# Altium schematic sheet NRF_remote_control_matrix_oled.SchDoc
size A4
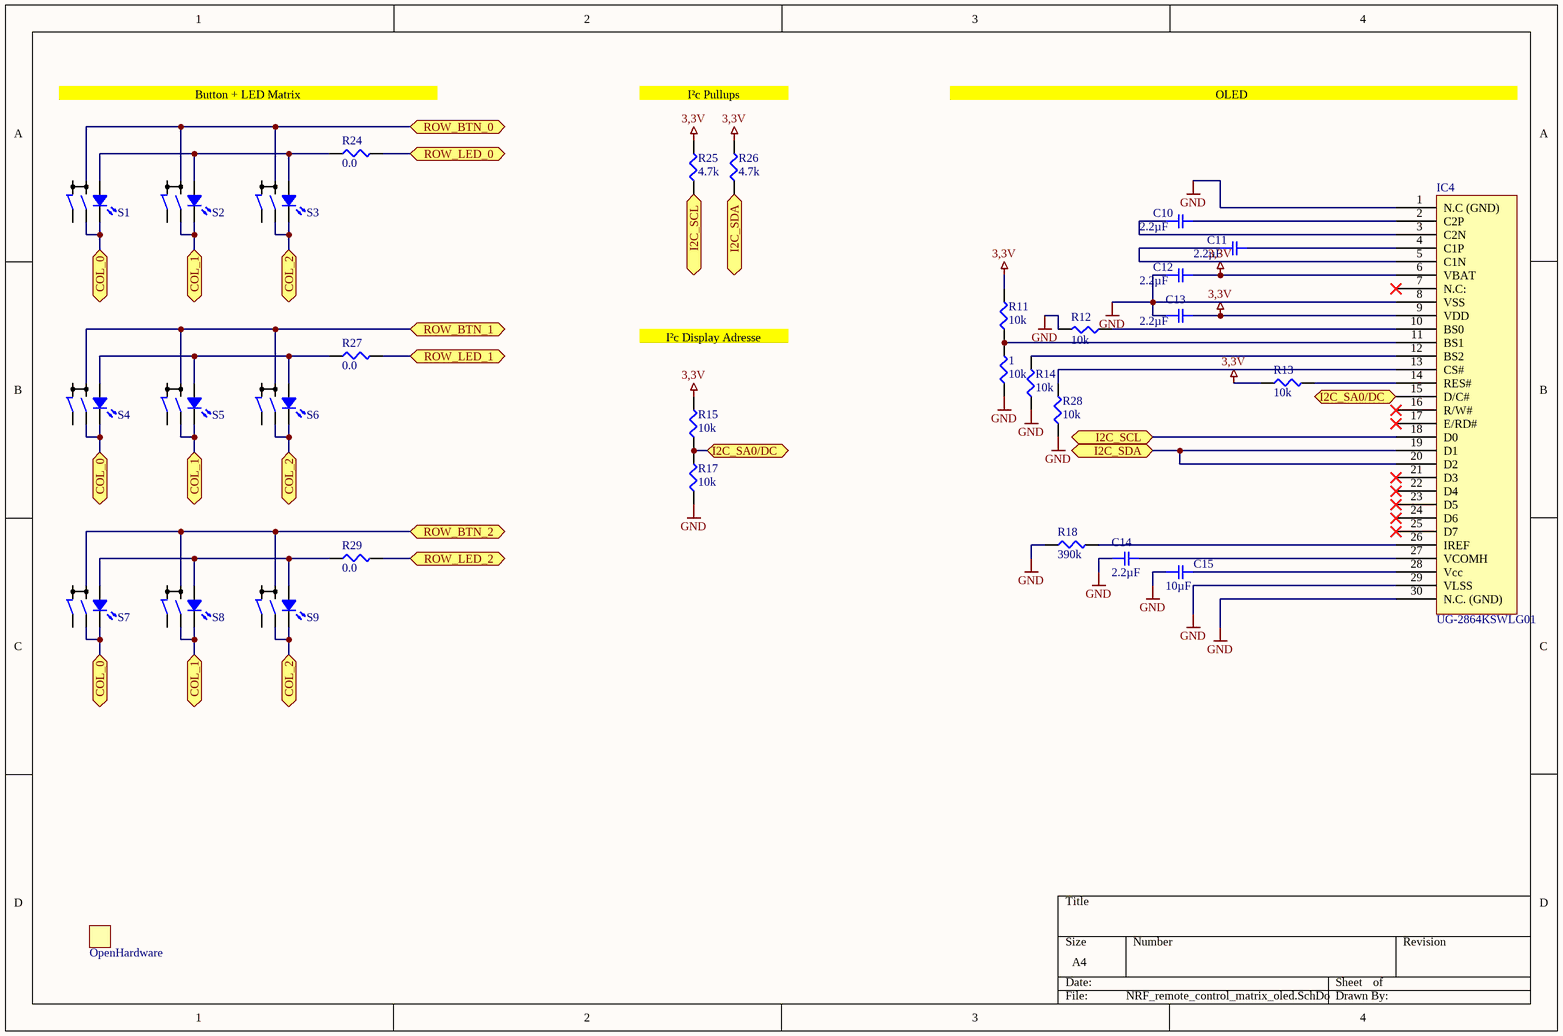
[diagram p0: NRF_remote_control_matrix_oled.SchDoc]

## Parts
1  10k  [SMD-0603-RES]
?  OpenHardware  [OpenHardware]
C10  2.2µF  [SMD-0603C]
C11  2.2µF  [SMD-0603C]
C12  2.2µF  [SMD-0603C]
C13  2.2µF  [SMD-0603C]
C14  2.2µF  [SMD-0603C]
C15  10µF  [SMD-0603C]
IC4  UG-2864KSWLG01  [UG-2864KSWLG01]
R11  10k  [SMD-0603-RES]
R12  10k  [SMD-0603-RES]
R13  10k  [SMD-0603-RES]
R14  10k  [SMD-0603-RES]
R15  10k  [SMD-0603-RES]
R17  10k  [SMD-0603-RES]
R18  390k  [SMD-0603-RES]
R24  0.0  [SMD-0603-RES]
R25  4.7k  [SMD-0603-RES]
R26  4.7k  [SMD-0603-RES]
R27  0.0  [SMD-0603-RES]
R28  10k  [SMD-0603-RES]
R29  0.0  [SMD-0603-RES]
S1  MP86A0BUH-G  [MP86A0BUH-G]  (value not drawn)
S2  MP86A0BUH-G  [MP86A0BUH-G]  (value not drawn)
S3  MP86A0BUH-G  [MP86A0BUH-G]  (value not drawn)
S4  MP86A0BUH-G  [MP86A0BUH-G]  (value not drawn)
S5  MP86A0BUH-G  [MP86A0BUH-G]  (value not drawn)
S6  MP86A0BUH-G  [MP86A0BUH-G]  (value not drawn)
S7  MP86A0BUH-G  [MP86A0BUH-G]  (value not drawn)
S8  MP86A0BUH-G  [MP86A0BUH-G]  (value not drawn)
S9  MP86A0BUH-G  [MP86A0BUH-G]  (value not drawn)

## Ports
COL_0 (bidir), COL_1 (bidir), COL_2 (bidir), I2C_SA0/DC (bidir), I2C_SCL (bidir), I2C_SDA (bidir), ROW_BTN_0 (bidir), ROW_BTN_1 (bidir), ROW_BTN_2 (bidir), ROW_LED_0 (bidir), ROW_LED_1 (bidir), ROW_LED_2 (bidir)

## Nets
3,3V: C12.2 C13.2 IC4.6(VBAT) IC4.9(VDD) R11.2 R13.1 R15.2 R25.2 R26.2
GND: 1.1 C12.1 C13.1 C14.1 C15.1 IC4.1(N.C_(GND)) IC4.8(VSS) IC4.29(VLSS) IC4.30(N.C._(GND)) R12.2 R14.1 R17.1 R18.1 R28.1
COL_0: S1.2 S1.C(K) S4.2 S4.C(K) S7.2 S7.C(K) ; port COL_0
COL_1: S2.2 S2.C(K) S5.2 S5.C(K) S8.2 S8.C(K) ; port COL_1
COL_2: S3.2 S3.C(K) S6.2 S6.C(K) S9.2 S9.C(K) ; port COL_2
I2C_SA0/DC: IC4.15(D/C#) R15.1 R17.2 ; port I2C_SA0/DC
I2C_SCL: IC4.18(D0) R25.1 ; port I2C_SCL
I2C_SDA: IC4.19(D1) IC4.20(D2) R26.1 ; port I2C_SDA
ROW_BTN_0: S1.1 S2.1 S3.1 ; port ROW_BTN_0
ROW_BTN_1: S4.1 S5.1 S6.1 ; port ROW_BTN_1
ROW_BTN_2: S7.1 S8.1 S9.1 ; port ROW_BTN_2
ROW_LED_0: R24.2 ; port ROW_LED_0
ROW_LED_1: R27.2 ; port ROW_LED_1
ROW_LED_2: R29.2 ; port ROW_LED_2
Net1_2: 1.2 IC4.11(BS1) R11.1
NetC10_1: C10.1 IC4.3(C2N)
NetC10_2: C10.2 IC4.2(C2P)
NetC11_1: C11.1 IC4.5(C1N)
NetC11_2: C11.2 IC4.4(C1P)
NetC14_2: C14.2 IC4.27(VCOMH)
NetC15_2: C15.2 IC4.28(Vcc)
NetIC4_10: IC4.10(BS0) R12.1
NetIC4_12: IC4.12(BS2) R14.2
NetIC4_13: IC4.13(CS#) R28.2
NetIC4_14: IC4.14(RES#) R13.2
NetIC4_26: IC4.26(IREF) R18.2
NetR24_1: R24.1 S1.B(A) S2.B(A) S3.B(A)
NetR27_1: R27.1 S4.B(A) S5.B(A) S6.B(A)
NetR29_1: R29.1 S7.B(A) S8.B(A) S9.B(A)

Not connected (* = marked no-connect by the designer): IC4 7(N.C:)* 16(R/W#)* 17(E/RD#)* 21(D3)* 22(D4)* 23(D5)* 24(D6)* 25(D7)*; S1 3; S2 3; S3 3; S4 3; S5 3; S6 3; S7 3; S8 3; S9 3

## Notes on the sheet
- Button + LED Matrix
- I²c Pullups
- OLED
- I²c Display Adresse

## Library data of the parts
1 R11-R15 R17 R28 = ERJ-3EKF1002V: RES SMD 10K OHM 1% 1/10W 0603; Manufacturer: Panasonic Electronic Components; Factory Stock: 0; Unit Price (USD): 0.00379; @ qty: 1500; Minimum Quantity: 1; Power (Watts): 0.1W, 1/10W; Temperature Coefficient: ±100ppm/°C; Part Number: ERJ-3EKF1002V; Datasheets: http://industrial.panasonic.com/www-cgi/jvcr13pz.cgi?E+PZ+3+AOA0002+ERJ3EKF1002V+7+WW; Image: //media.digikey.com/Photos/Panasonic%20Photos/MFG_ERJ-P6W%20Series.jpg; Digi-Key Part Number: P10.0KHCT-ND; Quantity Available: 6703141; Packaging: Cut Tape (CT); Series: ERJ; Part Status: Active; Value: 10k; Tolerance: ±1%; Composition: Thick Film; Features: Automotive AEC-Q200; Operating Temperature: -55°C ~ 155°C; Package / Case: 0603 (1608 Metric); Supplier Device Package: 0603; Size / Dimension: 0.063" L x 0.031" W (1.60mm x 0.80mm); Height - Seated (Max): 0.022" (0.55mm); Number of Terminations: 2; Failure Rate: -
? = OpenHardware: OpenHardware Logo
C10-C14 = GRM188C81C225KA12D: CAP CER 2.2UF 16V X6S 0603; Manufacturer: Murata Electronics North America; Factory Stock: 0; Unit Price (USD): 0.2; Minimum Quantity: 1; Tolerance: ±10%; Datasheets: http://www.murata.com/~/media/webrenewal/support/library/catalog/products/capacitor/mlcc/c02e.pdf; Image: //media.digikey.com/Renders/Murata%20Renders/ZRB-SERIES-0402.jpg; Digi-Key Part Number: 490-11993-1-ND; Part Number: GRM188C81C225KA12D; Quantity Available: 1215; @ qty: 0; Packaging: Cut Tape (CT); Series: GRM; Part Status: Active; Value: 2.2µF; Voltage: 16V; Temperature Coefficient: X6S; Operating Temperature: -55°C ~ 105°C; Features: -; Ratings: -; Applications: General Purpose; Mounting Type: Surface Mount, MLCC; Package / Case: 0603 (1608 Metric); Size / Dimension: 0.063" L x 0.031" W (1.60mm x 0.80mm); Height - Seated (Max): -; Thickness (Max): 0.035" (0.90mm); Lead Spacing: -; Lead Style: -
C15 = GRM185R60J106ME15D: CAP CER 10UF 6.3V X5R 0603; Manufacturer: Murata Electronics North America; Factory Stock: 0; Unit Price (USD): 0.36; Minimum Quantity: 1; Tolerance: ±20%; Datasheets: http://www.murata.com/~/media/webrenewal/support/library/catalog/products/capacitor/mlcc/c02e.pdf; Image: //media.digikey.com/Renders/Murata%20Renders/ZRB-SERIES-0402.jpg; Digi-Key Part Number: 490-10467-1-ND; Part Number: GRM185R60J106ME15D; Quantity Available: 25068; @ qty: 0; Packaging: Cut Tape (CT); Series: GRM; Part Status: Active; Value: 10µF; Voltage: 6.3V; Temperature Coefficient: X5R; Operating Temperature: -55°C ~ 85°C; Features: Derating Recommended; Ratings: -; Applications: General Purpose; Mounting Type: Surface Mount, MLCC; Package / Case: 0603 (1608 Metric); Size / Dimension: 0.063" L x 0.031" W (1.60mm x 0.80mm); Height - Seated (Max): -; Thickness (Max): 0.022" (0.55mm); Lead Spacing: -; Lead Style: -
IC4 = UG-2864KSWLG01: OLED 1,3" 128x64
R18 = ERJ-3EKF3903V: RES SMD 390K OHM 1% 1/10W 0603; Manufacturer: Panasonic Electronic Components; Factory Stock: 0; Unit Price (USD): 0.00379; @ qty: 1500; Minimum Quantity: 1; Power (Watts): 0.1W, 1/10W; Temperature Coefficient: ±100ppm/°C; Part Number: ERJ-3EKF3903V; Datasheets: http://industrial.panasonic.com/www-cgi/jvcr13pz.cgi?E+PZ+3+AOA0002+ERJ3EKF3903V+7+WW; Image: //media.digikey.com/Photos/Panasonic%20Photos/MFG_ERJ-P6W%20Series.jpg; Digi-Key Part Number: P390KHCT-ND; Quantity Available: 25618; Packaging: Cut Tape (CT); Series: ERJ; Part Status: Active; Value: 390k; Tolerance: ±1%; Composition: Thick Film; Features: Automotive AEC-Q200; Operating Temperature: -55°C ~ 155°C; Package / Case: 0603 (1608 Metric); Supplier Device Package: 0603; Size / Dimension: 0.063" L x 0.031" W (1.60mm x 0.80mm); Height - Seated (Max): 0.022" (0.55mm); Number of Terminations: 2; Failure Rate: -
R24 R27 R29 = ERJ-3GEY0R00V: RES SMD 0.0OHM JUMPER 1/10W 0603; Manufacturer: Panasonic Electronic Components; Factory Stock: 0; Unit Price (USD): 0.00352; @ qty: 1500; Minimum Quantity: 1; Power (Watts): 0.1W, 1/10W; Part Number: ERJ-3GEY0R00V; Datasheets: http://industrial.panasonic.com/www-cgi/jvcr13pz.cgi?E+PZ+3+AOA0001+ERJ3GEY0R00V+7+WW; Image: //media.digikey.com/Photos/Panasonic%20Photos/MFG_ERJ-P6W%20Series.jpg; Digi-Key Part Number: P0.0GCT-ND; Quantity Available: 4813372; Packaging: Cut Tape (CT); Series: ERJ; Part Status: Active; Value: 0.0; Tolerance: Jumper; Composition: Thick Film; Features: Automotive AEC-Q200; Temperature Coefficient: -; Operating Temperature: -55°C ~ 155°C; Package / Case: 0603 (1608 Metric); Supplier Device Package: 0603; Size / Dimension: 0.063" L x 0.031" W (1.60mm x 0.80mm); Height - Seated (Max): 0.022" (0.55mm); Number of Terminations: 2; Failure Rate: -
R25 R26 = ERJ-PA3F4701V: RES SMD 4.7K OHM 1% 1/4W 0603; Manufacturer: Panasonic Electronic Components; Factory Stock: 0; Unit Price (USD): 0.02372; @ qty: 1500; Minimum Quantity: 1; Power (Watts): 0.25W, 1/4W; Temperature Coefficient: ±100ppm/°C; Part Number: ERJ-PA3F4701V; Datasheets: https://industrial.panasonic.com/cdbs/www-data/pdf/RDA0000/AOA0000C243.pdf; Image: //media.digikey.com/Photos/Panasonic%20Photos/MFG_ERJ-P6W%20Series.jpg; Digi-Key Part Number: P4.7KBYCT-ND; Quantity Available: 14801; Packaging: Cut Tape (CT); Series: ERJ; Part Status: Active; Value: 4.7k; Tolerance: ±1%; Composition: Thick Film; Features: Automotive AEC-Q200, Pulse Withstanding; Operating Temperature: -55°C ~ 155°C; Package / Case: 0603 (1608 Metric); Supplier Device Package: 0603; Size / Dimension: 0.063" L x 0.031" W (1.60mm x 0.80mm); Height - Seated (Max): 0.022" (0.55mm); Number of Terminations: 2; Failure Rate: -
S1-S9 = MP86A0BUH-G: Button mit LED